# EAGLE design lcdbrd (EAGLE 6.4)
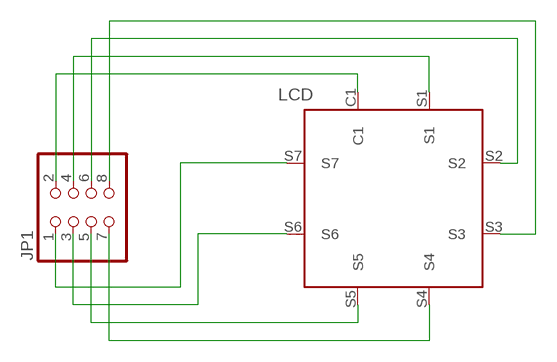
[diagram p0: schematic, sheet 1]

## Parts
JP1  PINHD-2X4  [2X04]
LCD  TH2028AR  [LCD_TH2028A]

## Nets
N$1: JP1.2 LCD.C1
N$2: JP1.4 LCD.S1
N$3: JP1.6 LCD.S2
N$4: JP1.8 LCD.S3
N$5: JP1.1 LCD.S7
N$6: JP1.3 LCD.S6
N$7: JP1.5 LCD.S5
N$8: JP1.7 LCD.S4

## Library data of the parts
JP1 = pinhead:PINHD-2X4: PIN HEADER
LCD = ezlib:TH2028A

## Board
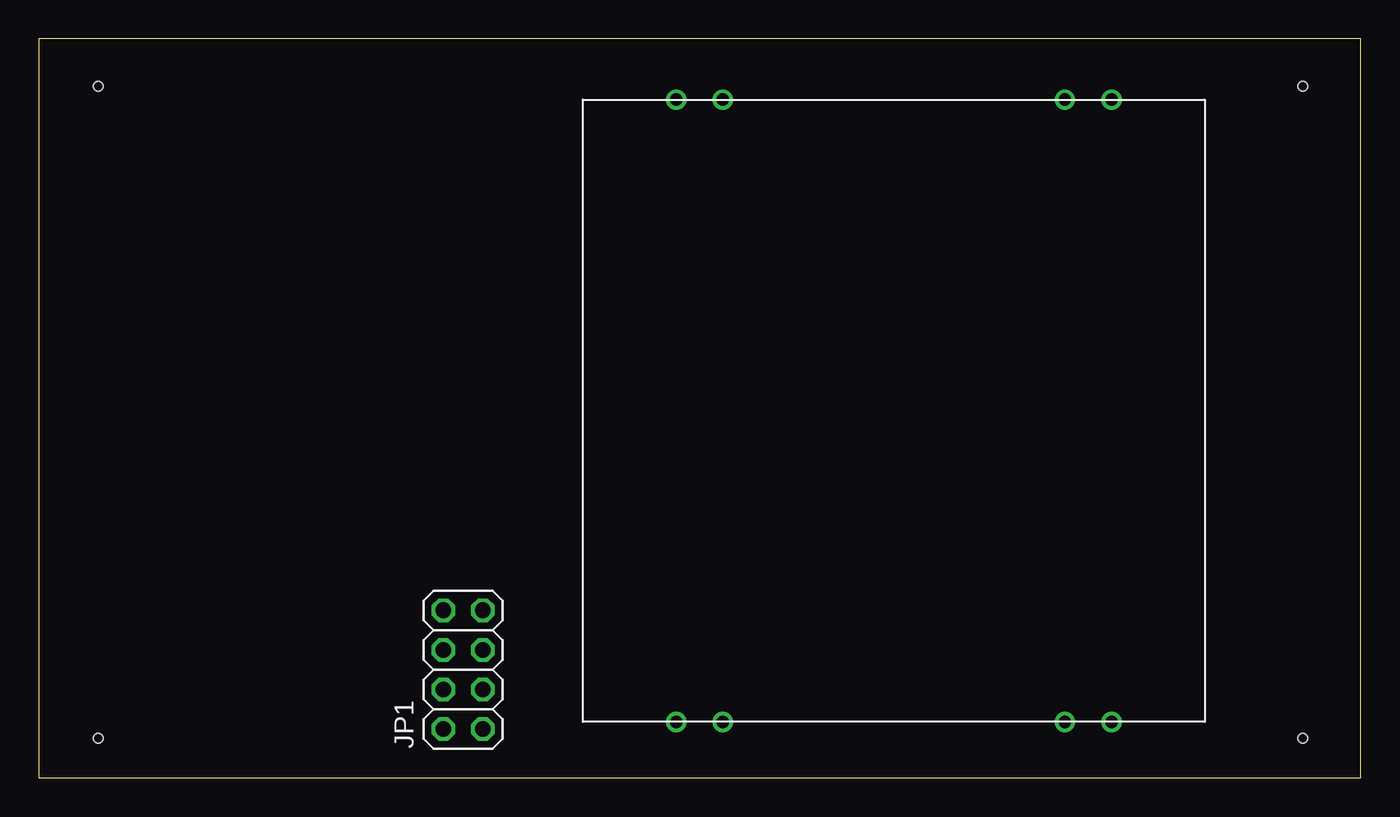
[diagram p1: board, top side]
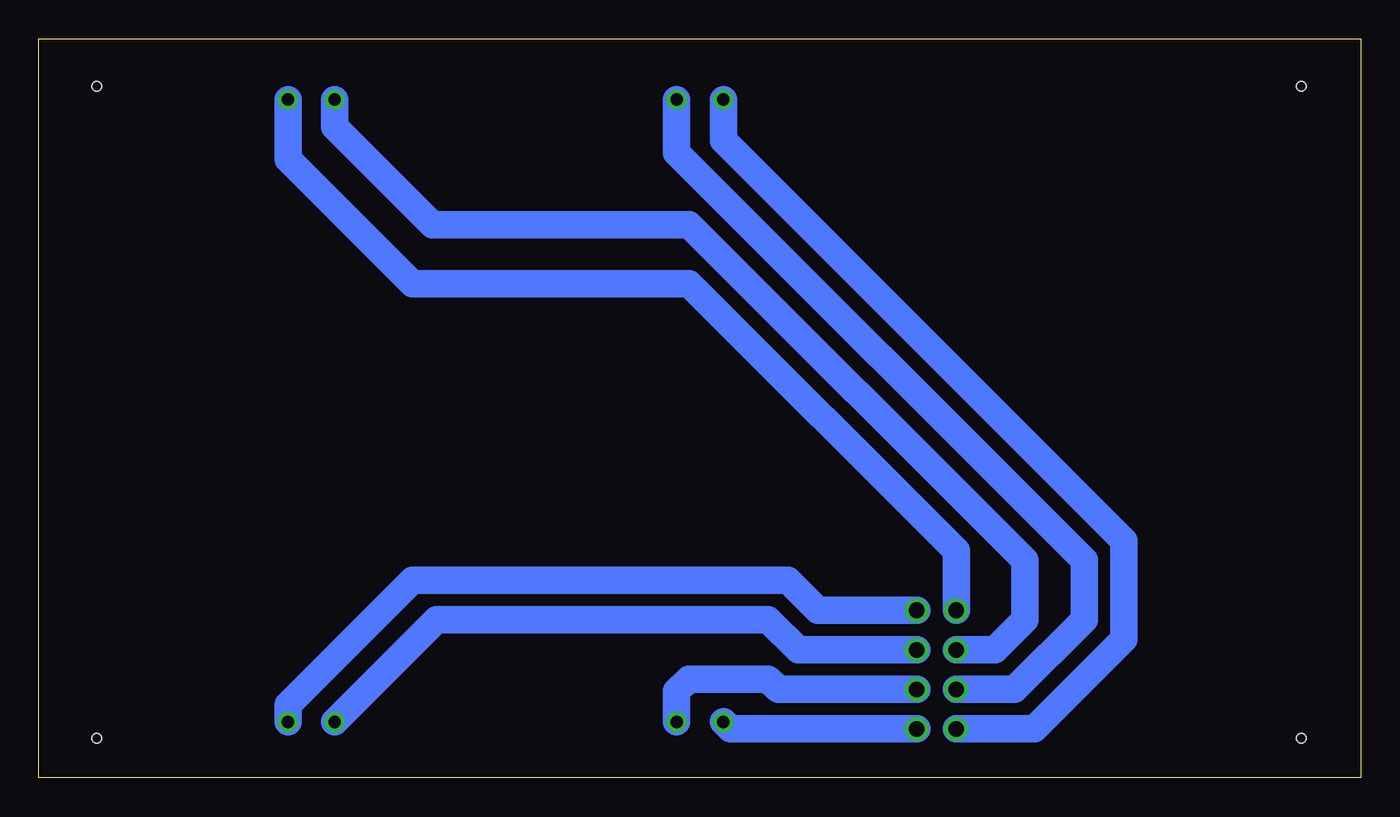
[diagram p2: board, bottom side, seen from below]

Size 85 x 47.5 mm. Coordinates in mm from the lower left corner, seen from the top.
Outline: 0,0 85,0 85,47.5 0,47.5 0,0
Copper layers (1*16): Top 0.035mm / dielectric 1.5mm / Bottom 0.035mm
Design rules "default": minimum track width 10mil, minimum drill 24mil, track to track 8mil, track to pad 8mil, pad to pad 8mil, via to via 8mil, smd to smd 8mil, copper to edge 40mil, drill to drill 8mil, minimum pad ring 10mil, minimum via ring 8mil, stop-mask expansion 4mil, vias tented up to drill 0mil, thermal gap 10mil
Holes 0.6 mm at 3.81,44.45 3.81,2.54 81.28,44.45 81.28,2.54

### Footprints (pad centres in the part's own frame; a part is rotated, then mirrored left to right if it is on the bottom)
2X04 = drill 1.016 octagon: 1 -3.81,-1.27; 2 -3.81,1.27; 3 -1.27,-1.27; 4 -1.27,1.27; 5 1.27,-1.27; 6 1.27,1.27; 7 3.81,-1.27; 8 3.81,1.27
LCD_TH2028A = drill 0.8: C1 -14,20; S1 -11,20; S2 11,20; S3 14,20; S4 14,-20; S5 11,-20; S6 -11,-20; S7 -14,-20

### Placement (x,y rotation side)
JP1  27.28,6.95 90 top
LCD  54.98,23.59 0 top

### Tracks (layer width: path | path; a pad name or v marks a point on that pad's centre or on a via)
N$1
  Bottom 1.778: JP1.2 20.99,3.14 15.24,8.89 15.24,15.24 40.98,40.98 LCD.C1
N$2
  Bottom 1.778: JP1.4 22.26,5.68 17.78,10.16 17.78,13.97 43.98,40.17 LCD.S1
N$3
  Bottom 1.778: JP1.6 23.53,8.22 21.59,10.16 21.59,13.97 43.18,35.56 59.69,35.56 65.98,41.85 LCD.S2
N$4
  Bottom 1.778: JP1.8 26.01,14.58 43.18,31.75 60.96,31.75 68.98,39.77 LCD.S3
N$5
  Bottom 1.778: LCD.S7 40.53,3.14 JP1.1
N$6
  Bottom 1.778: LCD.S6 43.98,5.55 43.18,6.35 38.1,6.35 37.43,5.68 JP1.3
N$7
  Bottom 1.778: JP1.5 36.16,8.22 38.1,10.16 59.41,10.16 LCD.S5
N$8
  Bottom 1.778: JP1.7 34.89,10.76 36.83,12.7 60.96,12.7 68.98,4.68 LCD.S4